# Altium schematic sheet RP2040_MCU.SchDoc: RP2040 CNC
size B; Author: AM; CompanyName: Expatria Technologies; DrawnBy: A.Marles; Engineer: AM; Organization: Expatria Technolgoies; Address1: Schematic; DocumentNumber: 3; SheetNumber: 3; SheetTotal: 4
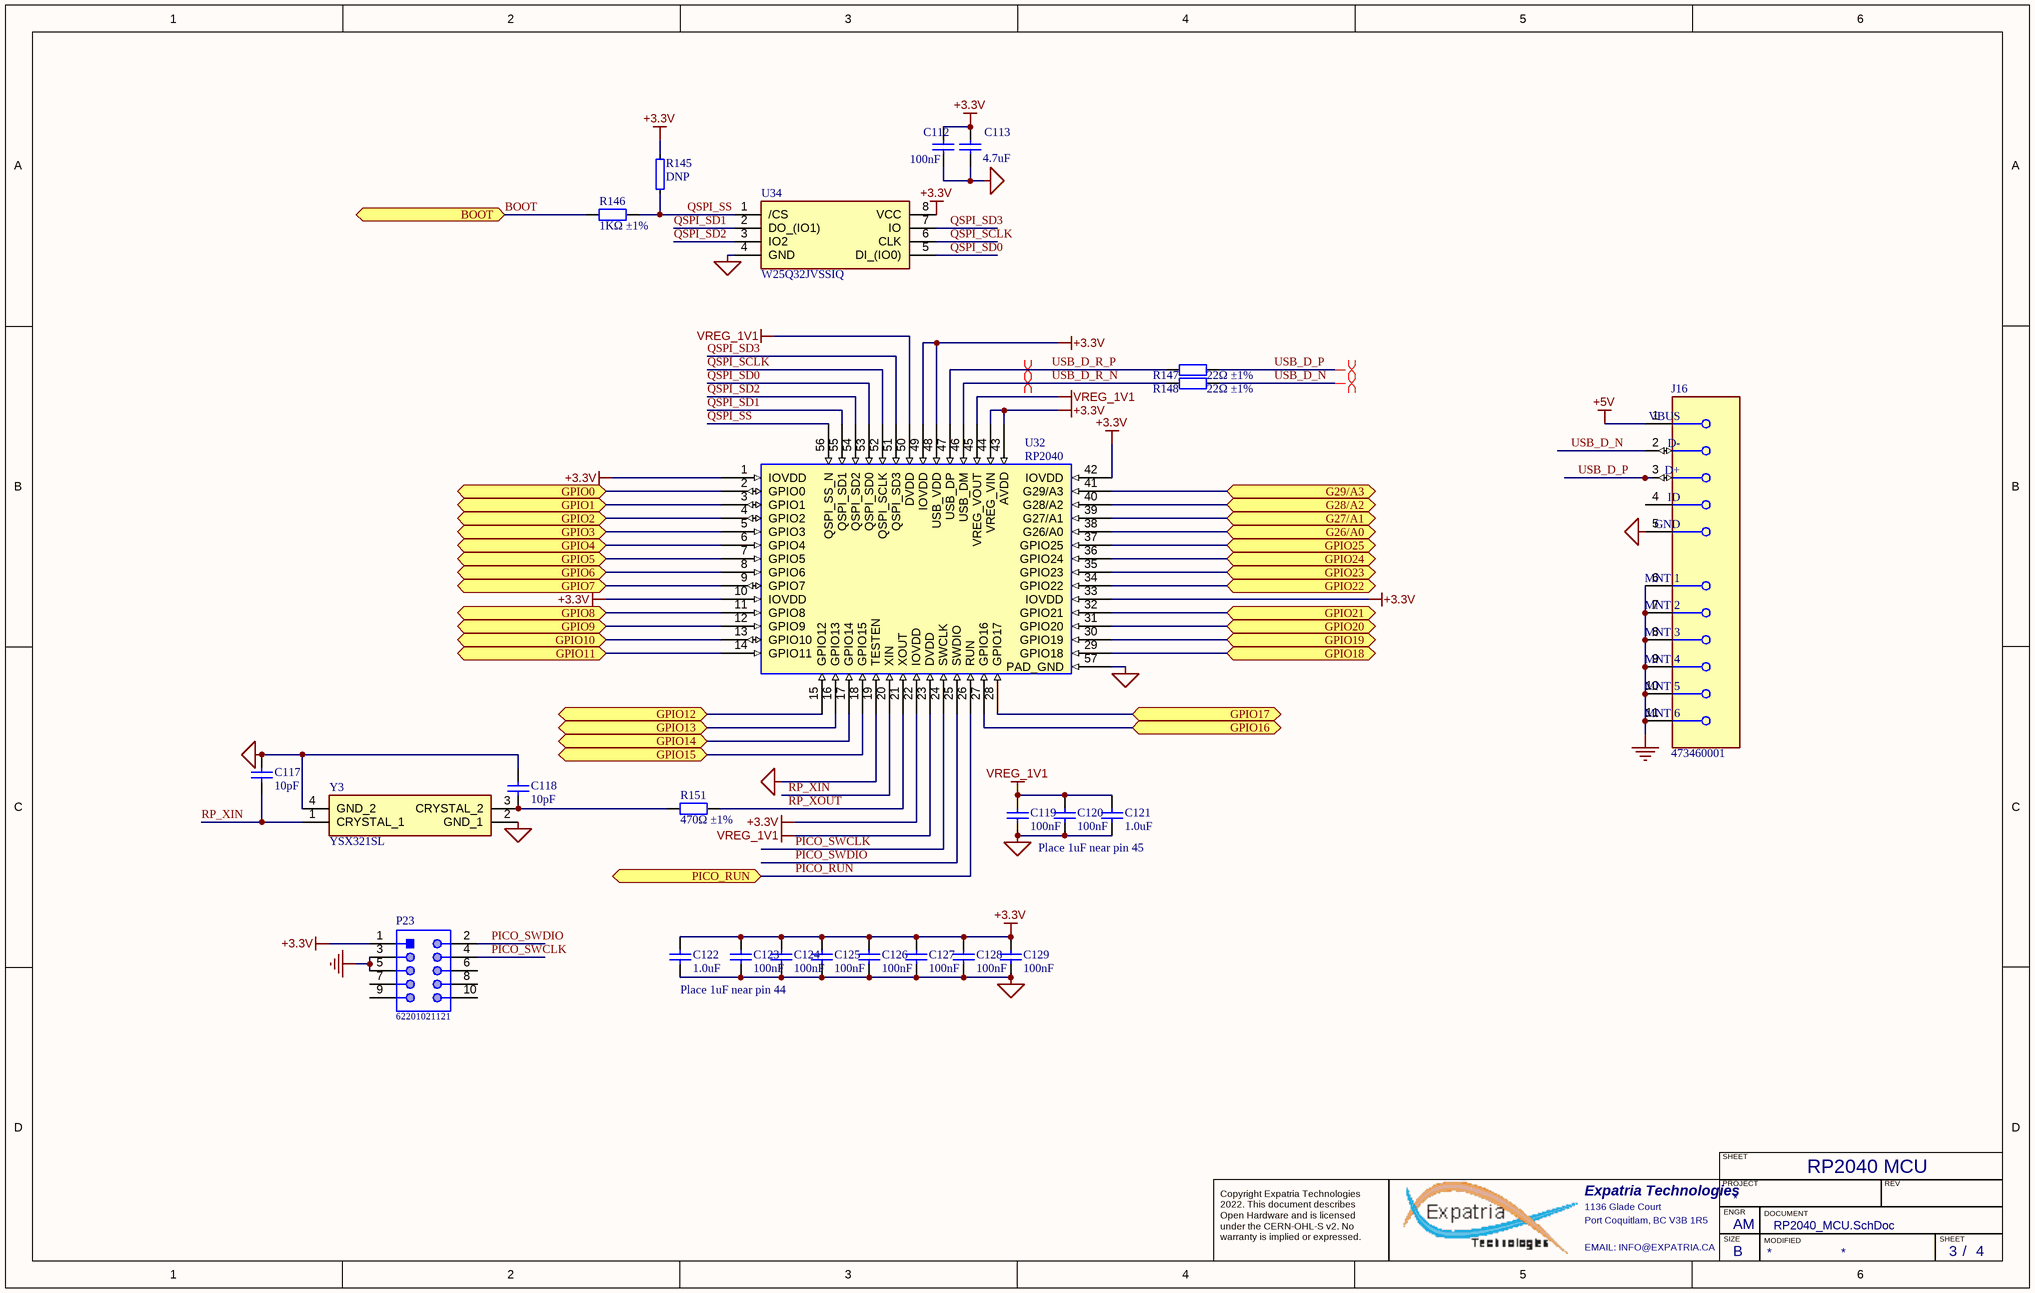
[diagram p0: RP2040_MCU.SchDoc]

## Parts
C112  100nF  [0402_C]
C113  4.7uF  [0402_C]
C117  10pF  [0402_C]
C118  10pF  [0402_C]
C119  100nF  [0402_C]
C120  100nF  [0402_C]
C121  1.0uF  [0402_C]
C122  1.0uF  [0402_C]
C123  100nF  [0402_C]
C124  100nF  [0402_C]
C125  100nF  [0402_C]
C126  100nF  [0402_C]
C127  100nF  [0402_C]
C128  100nF  [0402_C]
C129  100nF  [0402_C]
J16  473460001  [FP-473460001-MFG]
P23  62201021121  [62201021121]  (no BOM)
R145  DNP  [0402]
R146  1KΩ ±1%  [0402_R]
R147  22Ω ±1%  [0402_R]
R148  22Ω ±1%  [0402_R]
R151  470Ω ±1%  [0402_R]
U32  RP2040  [RP2040]
U34  W25Q32JVSSIQ  [SOIC127P780X195-8N]
Y3  YSX321SL  [YSX321SL]

## Ports
BOOT (bidir), G26/A0 (bidir), G27/A1 (bidir), G28/A2 (bidir), G29/A3 (bidir), GPIO0 (bidir), GPIO1 (bidir), GPIO2 (bidir), GPIO3 (bidir), GPIO4 (bidir), GPIO5 (bidir), GPIO6 (bidir), GPIO7 (bidir), GPIO8 (bidir), GPIO9 (bidir), GPIO10 (bidir), GPIO11 (bidir), GPIO12 (bidir), GPIO13 (bidir), GPIO14 (bidir), GPIO15 (bidir), GPIO16 (bidir), GPIO17 (bidir), GPIO18 (bidir), GPIO19 (bidir), GPIO20 (bidir), GPIO21 (bidir), GPIO22 (bidir), GPIO23 (bidir), GPIO24 (bidir), GPIO25 (bidir), PICO_RUN (bidir)

## Nets
+3.3V: C112.2 C113.2 C122.2 C123.2 C124.2 C125.2 C126.2 C127.2 C128.2 C129.2 P23.1 R145.2 U32.1(IOVDD) U32.10(IOVDD) U32.22(IOVDD) U32.33(IOVDD) U32.42(IOVDD) U32.43(AVDD) U32.44(VREG_VIN) U32.48(USB_VDD) U32.49(IOVDD) U34.8(VCC)
+5V: J16.1(VBUS)
GND: J16.6(MNT_1) J16.7(MNT_2) J16.8(MNT_3) J16.9(MNT_4) J16.10(MNT_5) J16.11(MNT_6) P23.3 P23.5
MCU_GND: C112.1 C113.1 C117.2 C118.2 C119.1 C120.1 C121.1 C122.1 C123.1 C124.1 C125.1 C126.1 C127.1 C128.1 C129.1 J16.5(GND) U32.19(TESTEN) U32.57(PAD_GND) U34.4(GND) Y3.2(GND_1) Y3.4(GND_2)
VREG_1V1: C119.2 C120.2 C121.2 U32.23(DVDD) U32.45(VREG_VOUT) U32.50(DVDD)
BOOT: R146.1 ; port BOOT
G26/A0: U32.38(G26/A0) ; port G26/A0
G27/A1: U32.39(G27/A1) ; port G27/A1
G28/A2: U32.40(G28/A2) ; port G28/A2
G29/A3: U32.41(G29/A3) ; port G29/A3
GPIO0: U32.2(GPIO0) ; port GPIO0
GPIO1: U32.3(GPIO1) ; port GPIO1
GPIO2: U32.4(GPIO2) ; port GPIO2
GPIO3: U32.5(GPIO3) ; port GPIO3
GPIO4: U32.6(GPIO4) ; port GPIO4
GPIO5: U32.7(GPIO5) ; port GPIO5
GPIO6: U32.8(GPIO6) ; port GPIO6
GPIO7: U32.9(GPIO7) ; port GPIO7
GPIO8: U32.11(GPIO8) ; port GPIO8
GPIO9: U32.12(GPIO9) ; port GPIO9
GPIO10: U32.13(GPIO10) ; port GPIO10
GPIO11: U32.14(GPIO11) ; port GPIO11
GPIO12: U32.15(GPIO12) ; port GPIO12
GPIO13: U32.16(GPIO13) ; port GPIO13
GPIO14: U32.17(GPIO14) ; port GPIO14
GPIO15: U32.18(GPIO15) ; port GPIO15
GPIO16: U32.27(GPIO16) ; port GPIO16
GPIO17: U32.28(GPIO17) ; port GPIO17
GPIO18: U32.29(GPIO18) ; port GPIO18
GPIO19: U32.30(GPIO19) ; port GPIO19
GPIO20: U32.31(GPIO20) ; port GPIO20
GPIO21: U32.32(GPIO21) ; port GPIO21
GPIO22: U32.34(GPIO22) ; port GPIO22
GPIO23: U32.35(GPIO23) ; port GPIO23
GPIO24: U32.36(GPIO24) ; port GPIO24
GPIO25: U32.37(GPIO25) ; port GPIO25
PICO_RUN: U32.26(RUN) ; port PICO_RUN
PICO_SWCLK: P23.4 U32.24(SWCLK)
PICO_SWDIO: P23.2 U32.25(SWDIO)
QSPI_SCLK: U32.52(QSPI_SCLK) U34.6(CLK)
QSPI_SD0: U32.53(QSPI_SD0) U34.5(DI_(IO0))
QSPI_SD1: U32.55(QSPI_SD1) U34.2(DO_(IO1))
QSPI_SD2: U32.54(QSPI_SD2) U34.3(IO2)
QSPI_SD3: U32.51(QSPI_SD3) U34.7(IO)
QSPI_SS: R145.1 R146.2 U32.56(QSPI_SS_N) U34.1(/CS)
RP_XIN: C117.1 U32.20(XIN) Y3.1(CRYSTAL_1)
RP_XOUT: R151.2 U32.21(XOUT)
USB_D_N: J16.2(D-) R148.1
USB_D_P: J16.3(D+) R147.1
USB_D_R_N: R148.2 U32.46(USB_DM)
USB_D_R_P: R147.2 U32.47(USB_DP)
NetC118_1: C118.1 R151.1 Y3.3(CRYSTAL_2)

Not connected (* = marked no-connect by the designer): J16 4(ID); P23 6 7 8 9 10

## Layout directives
differential pair: USB_D_N, USB_D_P, USB_D_R_N, USB_D_R_P

## Notes on the sheet
- Place 1uF near pin 45
- Place 1uF near pin 44
- RP2040 MCU
- SHEET
- Expatria Technologies
- 1136 Glade Court
- Port Coquitlam, BC V3B 1R5
- PROJECT
- SIZE
- ENGR
- MODIFIED
- DOCUMENT
- REV
- Copyright Expatria Technologies 2022. This document describes Open Hardware and is licensed under the CERN-OHL-S v2. No warranty is implied or expressed.
- EMAIL: INFO@EXPATRIA.CA
- B
- /

## Library data of the parts
C112 C119 C120 C123-C129 = 0402 100nF (104) 10% 16V: Chip capacitors; Manufacturer: Samsung Electro-Mechanics; PartNumber: CL05B104KO5NNNC; Tolerance: 10%; Voltage: 16V; ComponentLink1Description: Supplier link; ComponentLink1URL: http://www.szlcsc.com/product/details_1877.html; Package: 0402; Supplier: LC; SuppliersPartNumber: C1525; Capacitance: 100nF
C113 = 0402 4.7uF (475) 20% 10V: Chip capacitor; Manufacturer: Samsung Electro-Mechanics; PartNumber: CL05A475MP5NRNC; Tolerance: 20%; Voltage: 10V; ComponentLink1Description: Supplier link; ComponentLink1URL: http://www.szlcsc.com/product/details_24469.html; Package: 0402; Supplier: LC; SuppliersPartNumber: C23733; Capacitance: 4.7uF
C117 C118 = 0402 10pF (100) 5% 50V: Chip capacitors; Manufacturer: Samsung Electro-Mechanics; PartNumber: CL05C100JB5NNNC; Tolerance: 5%; Voltage: 50V; ComponentLink1Description: Supplier link; ComponentLink1URL: http://www.szlcsc.com/product/details_33914.html; Package: 0402; Supplier: LC; SuppliersPartNumber: C32949; Capacitance: 10pF
C121 C122 = 0402 1.0uF (105) 10% 25V: Chip capacitor; Manufacturer: Samsung Electro-Mechanics; PartNumber: CL05A105KA5NQNC; Capacitance: 1uF; Tolerance: 10%; Voltage: 25V; ComponentLink1Description: Supplier link; ComponentLink1URL: http://www.szlcsc.com/product/details_53938.html; Package: 0402; Supplier: LC; SuppliersPartNumber: C52923
J16 = CMP-2000-05246-2: CONN RCPT USB2.0 MICRO B SMD R/A; Manufacturer: Molex; Conn Orientation: Right Angle; Is Female: yes; Shielding: true; Pitch: 0.65mm; Number Of Contacts: 5; Voltage Rating: 30V; Current Rating: 1.8A; Device Class L2: USB Connectors; Digikey Description: CONN RCPT USB2.0 MICRO B SMD R/A; Height: 2.945mm; RoHS: TRUE; ComponentLink2Description: Datasheet; Octopart: https://octopart.com/47346-0001-molex-7164928; Automotive: No; Package: 0; Category: Conn; Device Class L1: Connectors; Usb Standard: USB 2.0; Temperature: -30°C to +85°C; Temperature Range Low: -30°C; Footprint Url: https://www.molex.com/pdm_docs/sd/473460001_sd.pdf; ComponentLink2URL: https://www.molex.com/webdocs/datasheets/pdf/en-us/0473460001_IO_CONNECTORS.pdf; Lead Free: Yes; Manufacturer Part Number: 473460001; Contact Material: Gold,Nickel; Temperature Range High: +85°C; Device Class L3: unset; SuppliersPartNumber: C132560
P23 = CMP-1502-00948-1: THT Vertical Pin Header WR-PHD, Pitch 1.27 mm, Dual Row, 10 pins; Manufacturer: Wurth Elektronik; Rated Current: 1A; Pin Number: 10; Working Voltage: 100VAC; Contact Resistance: 20mOhm; Withstanding Voltage: 500VAC; Pitch: 1.27mm; Gender: Male; Mounting Technology: THT; Manufacturer URL: http://www.we-online.de; Package Reference: 62201021121; Row Number: Dual; Datasheet URL: https://katalog.we-online.de/em/datasheet/62201021121.pdf; Publisher: WurthElektronik; Packaging: Box; Operating Temperature: -40to105degC; Orientation: Vertical; Part Number: 62201021121
R145 = RES: Resistor, ±5%, 0.05W; Part Number: R0201-0R; Part number IPS: 00000003245; Value: 0R; Note: Chip Res 5%; Artikkelnr Noca: N.A.; Manufacturer: *; Manufacturer Part Number: *; ComponentLink1URL: *; ComponentLink1Description: Datasheet; ComponentLink2URL: *; ComponentLink2Description: Supplier link; HelpURL: *; Footprint Doc: 0201; LatestRevisionDate: 2017-11-09; Pin Count: 2; Publisher: Nordic Semiconductor; Published: 2014-11-13; Supplier 1: *; Supplier Part Number 1: *; Supplier 2: *; Supplier Part Number 2: *
R146 = 0402 1K (1001) 1%: Chip resistor; Manufacturer: Uniroyal Elec; PartNumber: 0402WGF1001TCE; Power: 1/16W; ComponentLink1Description: Supplier link; ComponentLink1URL: http://www.szlcsc.com/product/details_12256.html; Package: 0402; Supplier: LC; SuppliersPartNumber: C11702; Resistance: 1KΩ; Tolerance: 1%
R147 R148 = 0402 22R (22R0) 1%: Chip resistor; Manufacturer: Uniroyal Elec; PartNumber: 0402WGF220JTCE; Power: 1/16W; ComponentLink1Description: Supplier link; ComponentLink1URL: http://www.szlcsc.com/product/details_25835.html; Package: 0402; Supplier: LC; SuppliersPartNumber: C25092; Resistance: 22Ω; Tolerance: 1%
R151 = 0402 470R (4700) 1%: Chip resistor; Manufacturer: Uniroyal Elec; PartNumber: 0402WGF4700TCE; Power: 1/16W; ComponentLink1Description: Supplier link; ComponentLink1URL: http://www.szlcsc.com/product/details_25860.html; Package: 0402; Supplier: LC; SuppliersPartNumber: C25117; Resistance: 470Ω; Tolerance: 1%
U32 = RP2040: RP2040 First MCU from RPI
U34 = W25Q128JVSIQ_TR: SPI Flash; Manufacturer_Name: Winbond; Manufacturer_Part_Number: W25Q128JVSIQ TR; Datasheet Link: http://www.winbond.com/resource-files/w25q128jv%20spi%20revc%2011162016.pdf; Height: 1.95mm; Mouser Part Number: 454-W25Q128JVSIQTR; Mouser Price/Stock: https://www.mouser.co.uk/ProductDetail/Winbond/W25Q128JVSIQ-TR?qs=qSfuJ%252Bfl%2Fd7vTyLA9kNdGw%3D%3D; Arrow Part Number: W25Q128JVSIQ TR; Arrow Price/Stock: https://www.arrow.com/en/products/w25q128jvsiqtr/winbond-electronics?region=nac; SuppliersPartNumber: C179173
Y3 = YSX321SL: Crystal or Oscillator; Manufacturer_Name: YXC; Datasheet Link: https://datasheet.lcsc.com/szlcsc/YSX321SL-30MHZ-10PF-8PPM_C70576.pdf; Height: 0.8mm; Manufacturer_Part_Number: YSX321SL; SuppliersPartNumber: C9002